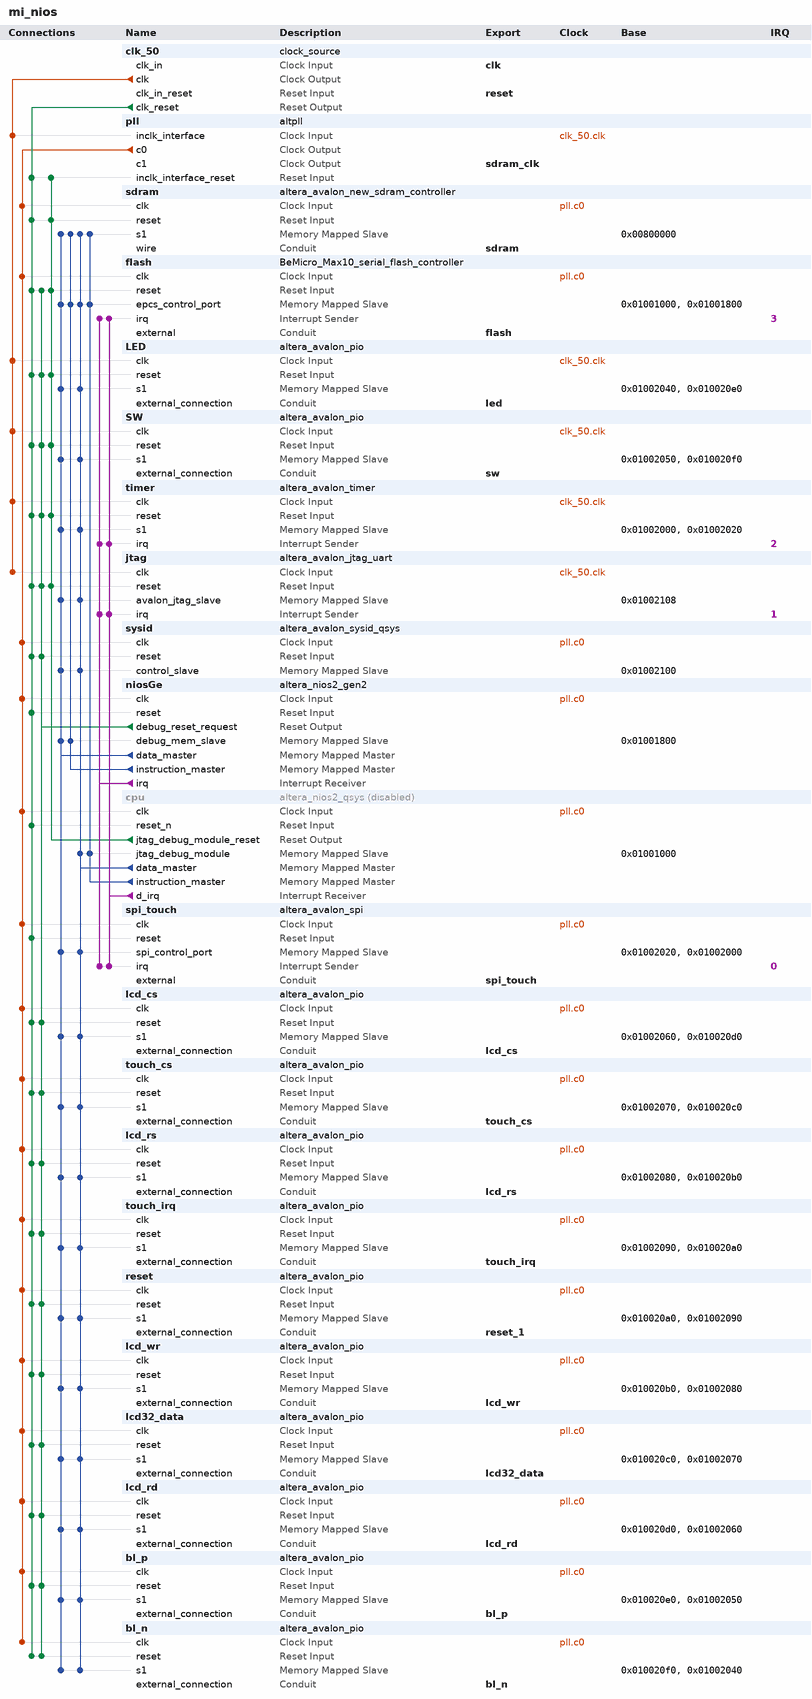
[diagram p0: system contents]
# Platform Designer (Qsys) system mi_nios, MAX 10 10M08DAF484C8GES
# Parameters at their usual value, and those the tool derives, are not listed.
package require -exact qsys 15.0
create_system mi_nios
set_project_property DEVICE_FAMILY {MAX 10}
set_project_property DEVICE 10M08DAF484C8GES

add_instance clk_50 clock_source 15.0
set_instance_parameter_value clk_50 clockFrequency 50000000

add_instance pll altpll 15.0
set_instance_parameter_value pll CLK0_DIVIDE_BY 5
set_instance_parameter_value pll CLK0_MULTIPLY_BY 8
set_instance_parameter_value pll CLK1_DIVIDE_BY 5
set_instance_parameter_value pll CLK1_DUTY_CYCLE 50
set_instance_parameter_value pll CLK1_MULTIPLY_BY 8
set_instance_parameter_value pll CLK1_PHASE_SHIFT -3125
set_instance_parameter_value pll INCLK0_INPUT_FREQUENCY 20000
set_instance_parameter_value pll PORT_ARESET PORT_UNUSED
set_instance_parameter_value pll PORT_LOCKED PORT_UNUSED
set_instance_parameter_value pll PORT_clk1 PORT_USED
set_instance_parameter_value pll PORT_clk2 PORT_UNUSED
set_instance_parameter_value pll PORT_clk3 PORT_UNUSED

add_instance sdram altera_avalon_new_sdram_controller 15.0
set_instance_parameter_value sdram TAC 5.4
set_instance_parameter_value sdram TRCD 15.0
set_instance_parameter_value sdram TRP 15.0
set_instance_parameter_value sdram casLatency 2
set_instance_parameter_value sdram columnWidth 8
set_instance_parameter_value sdram dataWidth 16
set_instance_parameter_value sdram generateSimulationModel false
set_instance_parameter_value sdram model single_Micron_MT48LC4M32B2_7_chip
set_instance_parameter_value sdram numberOfBanks 4
set_instance_parameter_value sdram numberOfChipSelects 1
set_instance_parameter_value sdram powerUpDelay 100.0
set_instance_parameter_value sdram refreshPeriod 15.625
set_instance_parameter_value sdram rowWidth 12

add_instance flash BeMicro_Max10_serial_flash_controller 14.0
set_instance_parameter_value flash autoSelectASMIAtom false
set_instance_parameter_value flash resetrequest_enabled true
set_instance_parameter_value flash useASMIAtom false

add_instance LED altera_avalon_pio 15.0
set_instance_parameter_value LED direction Output
set_instance_parameter_value LED width 8

add_instance SW altera_avalon_pio 15.0
set_instance_parameter_value SW direction Input
set_instance_parameter_value SW width 4

add_instance timer altera_avalon_timer 15.0
set_instance_parameter_value timer period 1
set_instance_parameter_value timer periodUnits MSEC

add_instance jtag altera_avalon_jtag_uart 15.0
set_instance_parameter_value jtag simInteractiveOptions NO_INTERACTIVE_WINDOWS

add_instance sysid altera_avalon_sysid_qsys 15.0
set_instance_parameter_value sysid id 0

add_instance niosGe altera_nios2_gen2 15.0
set_instance_parameter_value niosGe dcache_size 2048
set_instance_parameter_value niosGe dividerType srt2
set_instance_parameter_value niosGe exceptionSlave sdram.s1
set_instance_parameter_value niosGe icache_size 4096
set_instance_parameter_value niosGe impl Fast
set_instance_parameter_value niosGe resetSlave flash.epcs_control_port

add_instance cpu altera_nios2_qsys 15.0
set_instance_property cpu ENABLED false
set_instance_parameter_value cpu breakSlave cpu.jtag_debug_module
set_instance_parameter_value cpu exceptionSlave sdram.s1
set_instance_parameter_value cpu icache_size 4096
set_instance_parameter_value cpu impl Tiny
set_instance_parameter_value cpu mmu_TLBMissExcSlave None
set_instance_parameter_value cpu muldiv_multiplierType DSPBlock
set_instance_parameter_value cpu resetSlave flash.epcs_control_port
set_instance_parameter_value cpu resetrequest_enabled true

add_instance spi_touch altera_avalon_spi 15.0
set_instance_parameter_value spi_touch clockPolarity 0
set_instance_parameter_value spi_touch dataWidth 8
set_instance_parameter_value spi_touch masterSPI true
set_instance_parameter_value spi_touch numberOfSlaves 1
set_instance_parameter_value spi_touch targetClockRate 1000000

add_instance lcd_cs altera_avalon_pio 15.0
set_instance_parameter_value lcd_cs direction Output
set_instance_parameter_value lcd_cs width 1

add_instance touch_cs altera_avalon_pio 15.0
set_instance_parameter_value touch_cs direction Output
set_instance_parameter_value touch_cs width 1

add_instance lcd_rs altera_avalon_pio 15.0
set_instance_parameter_value lcd_rs direction Output
set_instance_parameter_value lcd_rs width 1

add_instance touch_irq altera_avalon_pio 15.0
set_instance_parameter_value touch_irq direction Input
set_instance_parameter_value touch_irq width 1

add_instance reset altera_avalon_pio 15.0
set_instance_parameter_value reset direction Output
set_instance_parameter_value reset width 1

add_instance lcd_wr altera_avalon_pio 15.0
set_instance_parameter_value lcd_wr direction Output
set_instance_parameter_value lcd_wr width 1

add_instance lcd32_data altera_avalon_pio 15.0
set_instance_parameter_value lcd32_data direction Bidir
set_instance_parameter_value lcd32_data width 16

add_instance lcd_rd altera_avalon_pio 15.0
set_instance_parameter_value lcd_rd direction Output
set_instance_parameter_value lcd_rd width 1

add_instance bl_p altera_avalon_pio 15.0
set_instance_parameter_value bl_p direction Output
set_instance_parameter_value bl_p width 1

add_instance bl_n altera_avalon_pio 15.0
set_instance_parameter_value bl_n direction Output
set_instance_parameter_value bl_n width 1

# connections
add_connection clk_50.clk jtag.clk clock
add_connection clk_50.clk LED.clk clock
add_connection clk_50.clk pll.inclk_interface clock
add_connection clk_50.clk SW.clk clock
add_connection clk_50.clk timer.clk clock
add_connection pll.c0 bl_n.clk clock
add_connection pll.c0 bl_p.clk clock
add_connection pll.c0 cpu.clk clock
add_connection pll.c0 flash.clk clock
add_connection pll.c0 lcd32_data.clk clock
add_connection pll.c0 lcd_cs.clk clock
add_connection pll.c0 lcd_rd.clk clock
add_connection pll.c0 lcd_rs.clk clock
add_connection pll.c0 lcd_wr.clk clock
add_connection pll.c0 niosGe.clk clock
add_connection pll.c0 reset.clk clock
add_connection pll.c0 sdram.clk clock
add_connection pll.c0 spi_touch.clk clock
add_connection pll.c0 sysid.clk clock
add_connection pll.c0 touch_cs.clk clock
add_connection pll.c0 touch_irq.clk clock
add_connection clk_50.clk_reset bl_n.reset reset
add_connection clk_50.clk_reset bl_p.reset reset
add_connection clk_50.clk_reset cpu.reset_n reset
add_connection clk_50.clk_reset flash.reset reset
add_connection clk_50.clk_reset jtag.reset reset
add_connection clk_50.clk_reset lcd32_data.reset reset
add_connection clk_50.clk_reset lcd_cs.reset reset
add_connection clk_50.clk_reset lcd_rd.reset reset
add_connection clk_50.clk_reset lcd_rs.reset reset
add_connection clk_50.clk_reset lcd_wr.reset reset
add_connection clk_50.clk_reset LED.reset reset
add_connection clk_50.clk_reset niosGe.reset reset
add_connection clk_50.clk_reset pll.inclk_interface_reset reset
add_connection clk_50.clk_reset reset.reset reset
add_connection clk_50.clk_reset sdram.reset reset
add_connection clk_50.clk_reset spi_touch.reset reset
add_connection clk_50.clk_reset SW.reset reset
add_connection clk_50.clk_reset sysid.reset reset
add_connection clk_50.clk_reset timer.reset reset
add_connection clk_50.clk_reset touch_cs.reset reset
add_connection clk_50.clk_reset touch_irq.reset reset
add_connection cpu.jtag_debug_module_reset flash.reset reset
add_connection cpu.jtag_debug_module_reset jtag.reset reset
add_connection cpu.jtag_debug_module_reset LED.reset reset
add_connection cpu.jtag_debug_module_reset pll.inclk_interface_reset reset
add_connection cpu.jtag_debug_module_reset sdram.reset reset
add_connection cpu.jtag_debug_module_reset SW.reset reset
add_connection cpu.jtag_debug_module_reset timer.reset reset
add_connection niosGe.debug_reset_request bl_n.reset reset
add_connection niosGe.debug_reset_request bl_p.reset reset
add_connection niosGe.debug_reset_request flash.reset reset
add_connection niosGe.debug_reset_request jtag.reset reset
add_connection niosGe.debug_reset_request lcd32_data.reset reset
add_connection niosGe.debug_reset_request lcd_cs.reset reset
add_connection niosGe.debug_reset_request lcd_rd.reset reset
add_connection niosGe.debug_reset_request lcd_rs.reset reset
add_connection niosGe.debug_reset_request lcd_wr.reset reset
add_connection niosGe.debug_reset_request LED.reset reset
add_connection niosGe.debug_reset_request reset.reset reset
add_connection niosGe.debug_reset_request SW.reset reset
add_connection niosGe.debug_reset_request sysid.reset reset
add_connection niosGe.debug_reset_request timer.reset reset
add_connection niosGe.debug_reset_request touch_cs.reset reset
add_connection niosGe.debug_reset_request touch_irq.reset reset
add_connection cpu.data_master bl_n.s1 avalon
set_connection_parameter_value cpu.data_master/bl_n.s1 baseAddress 0x01002040
add_connection cpu.data_master bl_p.s1 avalon
set_connection_parameter_value cpu.data_master/bl_p.s1 baseAddress 0x01002050
add_connection cpu.data_master cpu.jtag_debug_module avalon
set_connection_parameter_value cpu.data_master/cpu.jtag_debug_module baseAddress 0x01001000
add_connection cpu.data_master flash.epcs_control_port avalon
set_connection_parameter_value cpu.data_master/flash.epcs_control_port baseAddress 0x01001800
add_connection cpu.data_master jtag.avalon_jtag_slave avalon
set_connection_parameter_value cpu.data_master/jtag.avalon_jtag_slave baseAddress 0x01002108
add_connection cpu.data_master lcd32_data.s1 avalon
set_connection_parameter_value cpu.data_master/lcd32_data.s1 baseAddress 0x01002070
add_connection cpu.data_master lcd_cs.s1 avalon
set_connection_parameter_value cpu.data_master/lcd_cs.s1 baseAddress 0x010020d0
add_connection cpu.data_master lcd_rd.s1 avalon
set_connection_parameter_value cpu.data_master/lcd_rd.s1 baseAddress 0x01002060
add_connection cpu.data_master lcd_rs.s1 avalon
set_connection_parameter_value cpu.data_master/lcd_rs.s1 baseAddress 0x010020b0
add_connection cpu.data_master lcd_wr.s1 avalon
set_connection_parameter_value cpu.data_master/lcd_wr.s1 baseAddress 0x01002080
add_connection cpu.data_master LED.s1 avalon
set_connection_parameter_value cpu.data_master/LED.s1 baseAddress 0x010020e0
add_connection cpu.data_master reset.s1 avalon
set_connection_parameter_value cpu.data_master/reset.s1 baseAddress 0x01002090
add_connection cpu.data_master sdram.s1 avalon
set_connection_parameter_value cpu.data_master/sdram.s1 baseAddress 0x00800000
add_connection cpu.data_master spi_touch.spi_control_port avalon
set_connection_parameter_value cpu.data_master/spi_touch.spi_control_port baseAddress 0x01002000
add_connection cpu.data_master SW.s1 avalon
set_connection_parameter_value cpu.data_master/SW.s1 baseAddress 0x010020f0
add_connection cpu.data_master sysid.control_slave avalon
set_connection_parameter_value cpu.data_master/sysid.control_slave baseAddress 0x01002100
add_connection cpu.data_master timer.s1 avalon
set_connection_parameter_value cpu.data_master/timer.s1 baseAddress 0x01002020
add_connection cpu.data_master touch_cs.s1 avalon
set_connection_parameter_value cpu.data_master/touch_cs.s1 baseAddress 0x010020c0
add_connection cpu.data_master touch_irq.s1 avalon
set_connection_parameter_value cpu.data_master/touch_irq.s1 baseAddress 0x010020a0
add_connection cpu.instruction_master cpu.jtag_debug_module avalon
set_connection_parameter_value cpu.instruction_master/cpu.jtag_debug_module baseAddress 0x01001000
add_connection cpu.instruction_master flash.epcs_control_port avalon
set_connection_parameter_value cpu.instruction_master/flash.epcs_control_port baseAddress 0x01001800
add_connection cpu.instruction_master sdram.s1 avalon
set_connection_parameter_value cpu.instruction_master/sdram.s1 baseAddress 0x00800000
add_connection niosGe.data_master bl_n.s1 avalon
set_connection_parameter_value niosGe.data_master/bl_n.s1 baseAddress 0x010020f0
add_connection niosGe.data_master bl_p.s1 avalon
set_connection_parameter_value niosGe.data_master/bl_p.s1 baseAddress 0x010020e0
add_connection niosGe.data_master flash.epcs_control_port avalon
set_connection_parameter_value niosGe.data_master/flash.epcs_control_port baseAddress 0x01001000
add_connection niosGe.data_master jtag.avalon_jtag_slave avalon
set_connection_parameter_value niosGe.data_master/jtag.avalon_jtag_slave baseAddress 0x01002108
add_connection niosGe.data_master lcd32_data.s1 avalon
set_connection_parameter_value niosGe.data_master/lcd32_data.s1 baseAddress 0x010020c0
add_connection niosGe.data_master lcd_cs.s1 avalon
set_connection_parameter_value niosGe.data_master/lcd_cs.s1 baseAddress 0x01002060
add_connection niosGe.data_master lcd_rd.s1 avalon
set_connection_parameter_value niosGe.data_master/lcd_rd.s1 baseAddress 0x010020d0
add_connection niosGe.data_master lcd_rs.s1 avalon
set_connection_parameter_value niosGe.data_master/lcd_rs.s1 baseAddress 0x01002080
add_connection niosGe.data_master lcd_wr.s1 avalon
set_connection_parameter_value niosGe.data_master/lcd_wr.s1 baseAddress 0x010020b0
add_connection niosGe.data_master LED.s1 avalon
set_connection_parameter_value niosGe.data_master/LED.s1 baseAddress 0x01002040
add_connection niosGe.data_master niosGe.debug_mem_slave avalon
set_connection_parameter_value niosGe.data_master/niosGe.debug_mem_slave baseAddress 0x01001800
add_connection niosGe.data_master reset.s1 avalon
set_connection_parameter_value niosGe.data_master/reset.s1 baseAddress 0x010020a0
add_connection niosGe.data_master sdram.s1 avalon
set_connection_parameter_value niosGe.data_master/sdram.s1 baseAddress 0x00800000
add_connection niosGe.data_master spi_touch.spi_control_port avalon
set_connection_parameter_value niosGe.data_master/spi_touch.spi_control_port baseAddress 0x01002020
add_connection niosGe.data_master SW.s1 avalon
set_connection_parameter_value niosGe.data_master/SW.s1 baseAddress 0x01002050
add_connection niosGe.data_master sysid.control_slave avalon
set_connection_parameter_value niosGe.data_master/sysid.control_slave baseAddress 0x01002100
add_connection niosGe.data_master timer.s1 avalon
set_connection_parameter_value niosGe.data_master/timer.s1 baseAddress 0x01002000
add_connection niosGe.data_master touch_cs.s1 avalon
set_connection_parameter_value niosGe.data_master/touch_cs.s1 baseAddress 0x01002070
add_connection niosGe.data_master touch_irq.s1 avalon
set_connection_parameter_value niosGe.data_master/touch_irq.s1 baseAddress 0x01002090
add_connection niosGe.instruction_master flash.epcs_control_port avalon
set_connection_parameter_value niosGe.instruction_master/flash.epcs_control_port baseAddress 0x01001000
add_connection niosGe.instruction_master niosGe.debug_mem_slave avalon
set_connection_parameter_value niosGe.instruction_master/niosGe.debug_mem_slave baseAddress 0x01001800
add_connection niosGe.instruction_master sdram.s1 avalon
set_connection_parameter_value niosGe.instruction_master/sdram.s1 baseAddress 0x00800000
add_connection cpu.d_irq flash.irq interrupt
set_connection_parameter_value cpu.d_irq/flash.irq irqNumber 3
add_connection cpu.d_irq jtag.irq interrupt
set_connection_parameter_value cpu.d_irq/jtag.irq irqNumber 0
add_connection cpu.d_irq spi_touch.irq interrupt
set_connection_parameter_value cpu.d_irq/spi_touch.irq irqNumber 2
add_connection cpu.d_irq timer.irq interrupt
set_connection_parameter_value cpu.d_irq/timer.irq irqNumber 1
add_connection niosGe.irq flash.irq interrupt
set_connection_parameter_value niosGe.irq/flash.irq irqNumber 3
add_connection niosGe.irq jtag.irq interrupt
set_connection_parameter_value niosGe.irq/jtag.irq irqNumber 1
add_connection niosGe.irq spi_touch.irq interrupt
set_connection_parameter_value niosGe.irq/spi_touch.irq irqNumber 0
add_connection niosGe.irq timer.irq interrupt
set_connection_parameter_value niosGe.irq/timer.irq irqNumber 2

# exported interfaces
add_interface bl_n conduit end
set_interface_property bl_n EXPORT_OF bl_n.external_connection
add_interface bl_p conduit end
set_interface_property bl_p EXPORT_OF bl_p.external_connection
add_interface clk clock sink
set_interface_property clk EXPORT_OF clk_50.clk_in
add_interface flash conduit end
set_interface_property flash EXPORT_OF flash.external
add_interface lcd32_data conduit end
set_interface_property lcd32_data EXPORT_OF lcd32_data.external_connection
add_interface lcd_cs conduit end
set_interface_property lcd_cs EXPORT_OF lcd_cs.external_connection
add_interface lcd_rd conduit end
set_interface_property lcd_rd EXPORT_OF lcd_rd.external_connection
add_interface lcd_rs conduit end
set_interface_property lcd_rs EXPORT_OF lcd_rs.external_connection
add_interface lcd_wr conduit end
set_interface_property lcd_wr EXPORT_OF lcd_wr.external_connection
add_interface led conduit end
set_interface_property led EXPORT_OF LED.external_connection
add_interface reset reset sink
set_interface_property reset EXPORT_OF clk_50.clk_in_reset
add_interface reset_1 conduit end
set_interface_property reset_1 EXPORT_OF reset.external_connection
add_interface sdram conduit end
set_interface_property sdram EXPORT_OF sdram.wire
add_interface sdram_clk clock source
set_interface_property sdram_clk EXPORT_OF pll.c1
add_interface spi_touch conduit end
set_interface_property spi_touch EXPORT_OF spi_touch.external
add_interface sw conduit end
set_interface_property sw EXPORT_OF SW.external_connection
add_interface touch_cs conduit end
set_interface_property touch_cs EXPORT_OF touch_cs.external_connection
add_interface touch_irq conduit end
set_interface_property touch_irq EXPORT_OF touch_irq.external_connection

set_interconnect_requirement {$system} qsys_mm.clockCrossingAdapter HANDSHAKE
set_interconnect_requirement {$system} qsys_mm.insertDefaultSlave FALSE
set_interconnect_requirement {$system} qsys_mm.maxAdditionalLatency 1

save_system mi_nios.qsys
